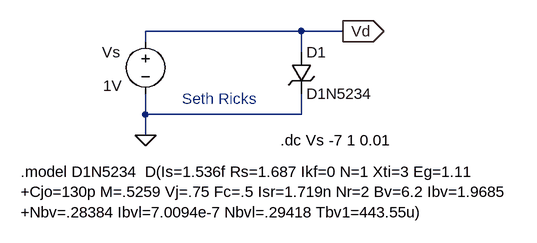
[diagram p0: schematic Zener_Diode.asc]
Zener_Diode.asc, the LTspice schematic file:
Version 4.1
SHEET 1 880 680
WIRE 304 112 64 112
WIRE 368 112 304 112
WIRE 64 128 64 112
WIRE 304 144 304 112
WIRE 64 240 64 208
WIRE 304 240 304 208
WIRE 304 240 64 240
WIRE 64 272 64 240
FLAG 64 272 0
FLAG 368 112 Vd
IOPIN 368 112 Out
SYMBOL voltage 64 112 R0
WINDOW 0 -67 32 Left 2
WINDOW 3 -65 84 Left 2
SYMATTR InstName Vs
SYMATTR Value 1V
SYMBOL zener 288 144 R0
SYMATTR InstName D1
SYMATTR Value D1N5234
TEXT -128 328 Left 2 !.model D1N5234  D(Is=1.536f Rs=1.687 Ikf=0 N=1 Xti=3 Eg=1.11 \n+Cjo=130p M=.5259 Vj=.75 Fc=.5 Isr=1.719n Nr=2 Bv=6.2 Ibv=1.9685 \n+Nbv=.28384 Ibvl=7.0094e-7 Nbvl=.29418 Tbv1=443.55u)
TEXT 272 280 Left 2 !.dc Vs -7 1 0.01
TEXT 120 216 Left 2 ;Seth Ricks

The netlist it stands for:
* Zener_Diode.asc
Vs Vd 0 1V
D1 Vd 0 D1N5234
.model D D
.lib standard.dio
.model D1N5234  D(Is=1.536f Rs=1.687 Ikf=0 N=1 Xti=3 Eg=1.11
+Cjo=130p M=.5259 Vj=.75 Fc=.5 Isr=1.719n Nr=2 Bv=6.2 Ibv=1.9685
+Nbv=.28384 Ibvl=7.0094e-7 Nbvl=.29418 Tbv1=443.55u)
.dc Vs -7 1 0.01
* Seth Ricks
.backanno
.end